# Altium schematic sheet Copy of ST_LINK_V3E.SchDoc: STLINK_V3E
size A3; Date: Not used; ApprovedBy: Not used; CheckedBy: Not used; Author: Not used; CompanyName: STMicroelectronics; DrawnBy: Not used; Engineer: Not used; Organization: Not used; Address1: Not used; Address2: Not used; Address3: Not used; Address4: Not used; DocumentNumber: 10; Revision: Not used; SheetNumber: 9; SheetTotal: 9; CurrentTime: Not used; CurrentDate: Not used; Time: Not used; DocumentFullPathAndName: Not used; DocumentName: Not used; ModifiedDate: Not used; ImagePath: Not used; ProjectName: Not used; Application_BuildNumber: Not used
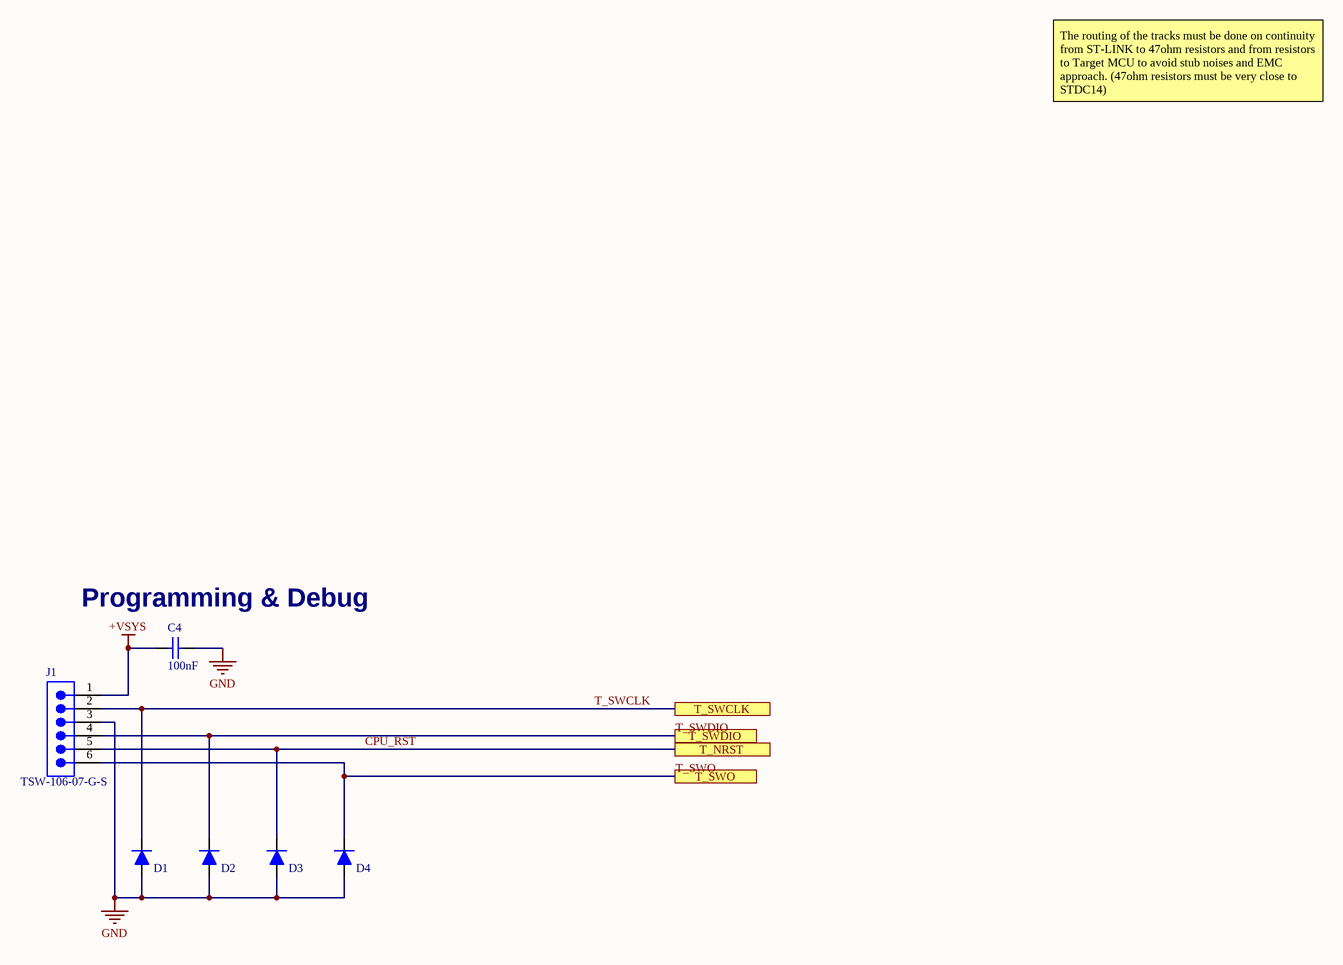
[diagram p0: Copy of ST_LINK_V3E.SchDoc]

## Parts
C4  100nF  [0402]
D1  CG0603MLC-3.3LE  [ESD PROTECTOR]  (value not drawn)
D2  CG0603MLC-3.3LE  [ESD PROTECTOR]  (value not drawn)
D3  CG0603MLC-3.3LE  [ESD PROTECTOR]  (value not drawn)
D4  CG0603MLC-3.3LE  [ESD PROTECTOR]  (value not drawn)
J1  TSW-106-07-G-S  [SMTC-TSW-106-07-X-S]

## Ports
T_NRST, T_SWCLK, T_SWDIO, T_SWO

## Nets
+VSYS: C4.1 J1.1
GND: C4.2 D1.2(A) D2.2(A) D3.2(A) D4.2(A) J1.3
CPU_RST: D3.1(K) J1.5 ; port T_NRST
T_SWCLK: D1.1(K) J1.2 ; port T_SWCLK
T_SWDIO: D2.1(K) J1.4 ; port T_SWDIO
T_SWO: D4.1(K) J1.6 ; port T_SWO

## Notes on the sheet
- The routing of the tracks must be done on continuity from ST-LINK to 47ohm resistors and from resistors to Target MCU to avoid stub noises and EMC approach. (47ohm resistors must be very close to STDC14)
- (near C4) Programming & Debug
- Title:
- Project:
- Size:
- Revision:
- Variant:
- A3
- -
- Date:
- Reference:
- Sheet:
- of

## Library data of the parts
C4 = 04025D104KAT2A: 0402 (1005Metric) CERAMIC CAPACITOR ceramic capacitor 50V 0.1muF ±10% X5R; Manufacturer: Kyocera AVX; Material: 4241ConductorMaterial; Supplier 1: Arrow Electronics; Manufacturer Part Number: 04025D104KAT2A; RoHS: Yes; Category: Ceramic Capacitors; Stock 1: 10000; Pricing 1: 10000=0,008, 20000=0,007, 30000=0,0069, 100000=0,006, 150000=0,0059 (USD); Mounting Technology: Surface Mount; Case/Package: 0402; Case Code (Imperial): 0402; Case Code (Metric): 1005; Min Operating Temperature: -55°C; Max Operating Temperature: 85°C; Value: 100nF; Series: -; Packaging: Cut Tape; Voltage Rating: 50V; Tolerance: 10%; Voltage Rating (DC): 50V; Height: 560um; RoHS Compliant: Yes; ComponentLink1URL: https://datasheet.octopart.com/04025D104KAT2A-KYOCERA-AVX-datasheet-155912759.pdf?src-supplier=Future+Electronics; ComponentLink1Description: https://datasheet.octopart.com/04025D104KAT2A-KYOCERA-AVX-datasheet-155912759.pdf?src-supplier=Future+Electronics; ComponentLink2URL: http://datasheets.avx.com/cx5r.pdf?src-supplier=Digikey; ComponentLink2Description: http://datasheets.avx.com/cx5r.pdf?src-supplier=Digikey
D1-D4 = CG0603MLC-3.3LE: MLC Series Multilayer Varistor 0.5pF; Clamping 25V 0603 Case; Manufacturer: Bourns; Voltage Rating (DC): 3.3V; Number of Circuits: 1; Current Rating: 5nA; Element Configuration: Single; RoHS 1: Yes; Category: Varistors; Stock 1: 105939; Pricing 1: 1=0,37000, 10=0,29900, 25=0,27360, 100=0,20360, 250=0,18452, 500=0,15272, 1000=0,11453, 2500=0,10499 (USD); Mount: Surface Mount; Case/Package: 0603; Number of Pins: 2; Case Code (Metric): 1608; Case Code (Imperial): 0603; Contact Plating: Tin; Min Operating Temperature: -40°C; Max Operating Temperature: 85°C; Package Quantity: 5000; Capacitance: 0.5pF; Packaging: Tape and Reel; Operating Supply Voltage: 3.3V; Max Voltage Rating (DC): 3.3V; Number of Channels: 1; Clamping Voltage: 25V; Termination: SMD/SMT; Voltage: 3.3V; Working Voltage: 3.3V; Leakage Current: 5nA; Series: MLC; Length: 1.6mm; Width: 0.8mm; Depth: 0.8mm; Radiation Hardening: No; Reach SVHC Compliant: Yes; RoHS Compliant: Yes; ComponentLink1URL: https://datasheet.ciiva.com/366/mlc-366192.pdf?src-supplier=Digi-Key; ComponentLink1Description: https://datasheet.ciiva.com/366/mlc-366192.pdf?src-supplier=Digi-Key; ComponentLink2URL: https://datasheet.ciiva.com/11834/0900766b80dbb952-11834610.pdf?src-supplier=RSComponents; ComponentLink2Description: https://datasheet.ciiva.com/11834/0900766b80dbb952-11834610.pdf?src-supplier=RSComponents; ComponentLink3URL: https://datasheet.ciiva.com/366/mlc-366190.pdf?src-supplier=Digi-Key; ComponentLink3Description: https://datasheet.ciiva.com/366/mlc-366190.pdf?src-supplier=Digi-Key; ComponentLink4URL: https://datasheet.ciiva.com/366/mlc-366191.pdf?src-supplier=Digi-Key; ComponentLink4Description: https://datasheet.ciiva.com/366/mlc-366191.pdf?src-supplier=Digi-Key; ComponentLink5URL: https://datasheet.ciiva.com/10437/mlc-10437033.pdf?src-supplier=Avnet; ComponentLink5Description: https://datasheet.ciiva.com/10437/mlc-10437033.pdf?src-supplier=Avnet; ComponentLink6URL: https://datasheet.ciiva.com/46435/1785244-46435096.pdf?src-supplier=Element14; ComponentLink6Description: https://datasheet.ciiva.com/46435/1785244-46435096.pdf?src-supplier=Element14; Supplier 1: Digi-Key; Supplier Part Number 1: CG0603MLC-3.3LECT-ND; Manufacturer Part Number 1: CG0603MLC-3.3LE
J1 = CMP-1024-00383-1: 0.025" SQ Post Header, Through-hole, Vertical, -55 to 125 degC, 2.54 mm Pitch, 6-Pin, Male, RoHS; Manufacturer: Samtec; Pitch: 2.54 mm; RoHS: True; ComponentLink1Description: Manufacturer URL; DatasheetVersion: F-214; Orientation: Vertical; ComponentLink1URL: http://www.samtec.com; ComponentLink3Description: Package Specification; ComponentLink2Description: Datasheet; PackageVersion: DM, 8/1988; PackageDescription: .025[0.64] SQ. Post Terminal Strip Assembly; PackageReference: TSW-106-07-X-S; Mounting Technology: Through-hole; Temperature Range: -55 to 125 degC; ComponentLink3URL: http://www.samtec.com/documents/webfiles/cpdf/TSW-XXX-XX-XXX-X-XX-XXX-MKT.pdf; ComponentLink2URL: http://www.samtec.com/documents/webfiles/pdf/TSW_TH.PDF; PartNumber: TSW-106-07-G-S